# Altium schematic sheet Sound.SchDoc
size A4
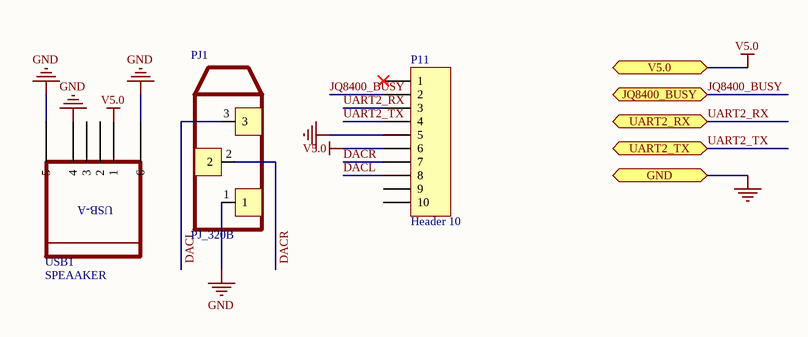
[diagram p0: Sound.SchDoc]

## Parts
P11  Header 10  [HDR1X10]
PJ1  PJ_320B  [PJ-320B]
USB1  SPEAAKER  [USB-A]

## Ports
GND, JQ8400_BUSY, UART2_RX, UART2_TX, V5.0

## Nets
GND: P11.5 PJ1.1 USB1.4 USB1.5 USB1.6 ; port GND
V5.0: P11.6 USB1.1 ; port V5.0
DACL: P11.8 PJ1.3
DACR: P11.7 PJ1.2
JQ8400_BUSY: P11.2 ; port JQ8400_BUSY
UART2_RX: P11.3 ; port UART2_RX
UART2_TX: P11.4 ; port UART2_TX

Not connected (* = marked no-connect by the designer): P11 1* 9 10; USB1 2 3

## Library data of the parts
P11 = Header 10: Header, 10-Pin; LatestRevisionDate: 17-Jul-2002; LatestRevisionNote: Re-released for DXP Platform.; Publisher: Altium Limited
USB1 = USB-A